# Altium schematic sheet TDS Sensor Unit.SchDoc
size A4; SheetNumber: 6; SheetTotal: 8
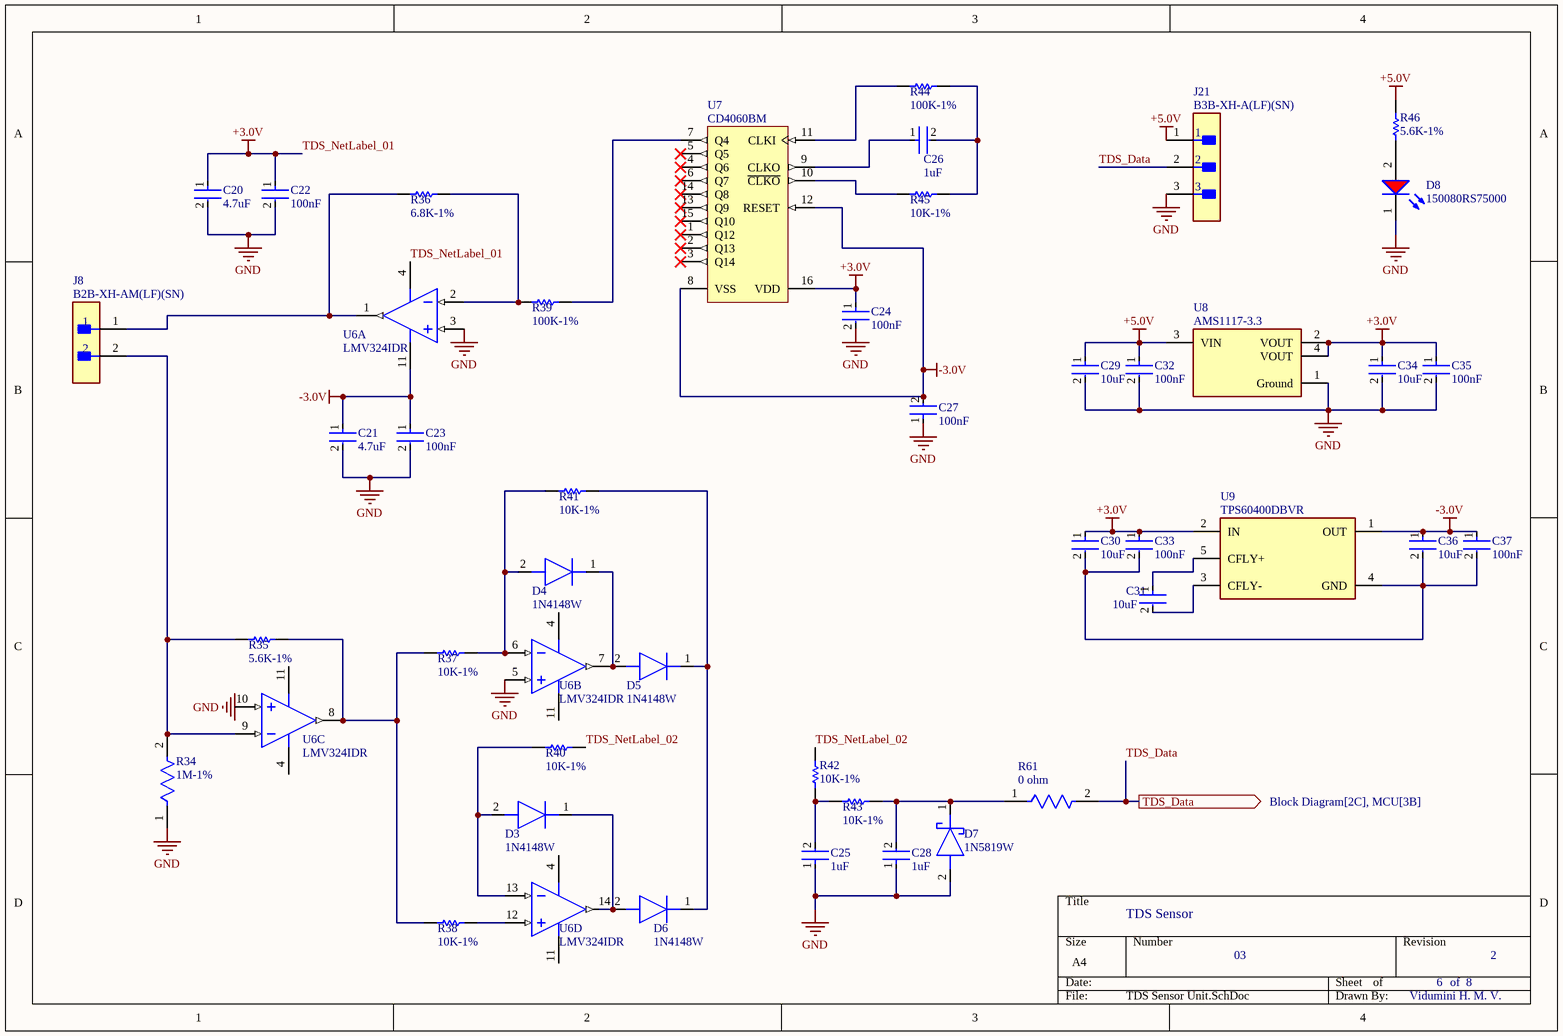
[diagram p0: TDS Sensor Unit.SchDoc]

## Parts
C20  4.7uF  [FP-1206-L_3_2_0_2-W_1_6_0-MFG]
C21  4.7uF  [FP-1206-L_3_2_0_2-W_1_6_0-MFG]
C22  100nF  [FP-1206-L_3_2_0_2-W_1_6_0-IPC_C]
C23  100nF  [FP-1206-L_3_2_0_2-W_1_6_0-IPC_C]
C24  100nF  [FP-1206-L_3_2_0_2-W_1_6_0-IPC_C]
C25  1uF  [FP-0805-L_2_01_0_2-W_1_25-MFG]
C26  1uF  [FP-0805-L_2_01_0_2-W_1_25-MFG]
C27  100nF  [FP-1206-L_3_2_0_2-W_1_6_0-IPC_C]
C28  1uF  [FP-0805-L_2_01_0_2-W_1_25-MFG]
C29  10uF  [FP-1206-L_3_2_0_2-W_1_6_0-IPC_B]
C30  10uF  [FP-1206-L_3_2_0_2-W_1_6_0-IPC_B]
C31  10uF  [FP-1206-L_3_2_0_2-W_1_6_0-IPC_B]
C32  100nF  [FP-1206-L_3_2_0_2-W_1_6_0-IPC_C]
C33  100nF  [FP-1206-L_3_2_0_2-W_1_6_0-IPC_C]
C34  10uF  [FP-1206-L_3_2_0_2-W_1_6_0-IPC_B]
C35  100nF  [FP-1206-L_3_2_0_2-W_1_6_0-IPC_C]
C36  10uF  [FP-1206-L_3_2_0_2-W_1_6_0-IPC_B]
C37  100nF  [FP-1206-L_3_2_0_2-W_1_6_0-IPC_C]
D3  1N4148W  [SOD3716X125N]
D4  1N4148W  [SOD3716X125N]
D5  1N4148W  [SOD3716X125N]
D6  1N4148W  [SOD3716X125N]
D7  1N5819W  [SODFL3618X110N]
D8  150080RS75000  [WL-SMCW_0805_150080xx75000]
J8  B2B-XH-AM(LF)(SN)  [FP-B2B-XH-AM_LF_SN-MFG]
J21  B3B-XH-A(LF)(SN)  [FP-B3B-XH-A_LF_SN-MFG]
R34  1M-1%  [FP-CRCW1206-e3-MFG]
R35  5.6K-1%  [RESC3116X65X40ML10T20]
R36  6.8K-1%  [RESC3116X65X40ML10T20]
R37  10K-1%  [RESC3116X65X40ML10T20]
R38  10K-1%  [RESC3116X65X40ML10T20]
R39  100K-1%  [RESC3116X65X40ML10T20]
R40  10K-1%  [RESC3116X65X40ML10T20]
R41  10K-1%  [RESC3116X65X40ML10T20]
R42  10K-1%  [RESC3116X65X40ML10T20]
R43  10K-1%  [RESC3116X65X40ML10T20]
R44  100K-1%  [RESC3116X65X40ML10T20]
R45  10K-1%  [RESC3116X65X40ML10T20]
R46  5.6K-1%  [RESC3116X65X40ML10T20]
R61  0 ohm  [FP-AF0603-IPC_B]
U6  LMV324IDR  [D0014A_V]  (parts A,B,C,D of 4)
U7  CD4060BM  [D0016A_M]
U8  AMS1117-3.3  [FP-AMS1117-IPC_C]
U9  TPS60400DBVR  [FP-DBV0005A-IPC_B]

## Ports
TDS_Data (out, see Block Diagram[2C], MCU[3B])

## Nets
+5.0V: C29.1 C32.1 J21.1 R46.2 U8.3(VIN)
-3.0V: C21.1 C23.1 C27.2 C36.1 C37.1 U6.11(GND) U7.8(VSS) U7.12(RESET) U9.1(OUT)
GND: C20.2 C21.2 C22.2 C23.2 C24.2 C25.1 C27.1 C28.1 C29.2 C32.2 C34.2 C35.2 D7.2(A) D8.1(K) J21.3 R34.1 U6.3(1IN+) U6.5(2IN+) U8.1(Ground)
TDS_NetLabel_01: C20.1 C22.1 C24.1 C30.1 C33.1 C34.1 C35.1 U6.4(VCC+) U7.16(VDD) U8.2(VOUT) U8.4(VOUT) U9.2(IN)  [also labelled +3.0V]
TDS_Data: J21.2 R61.2 ; port TDS_Data
TDS_NetLabel_02: R40.2 R42.1
NetC25_2: C25.2 R42.2 R43.1
NetC26_1: C26.1 U7.9(CLKO)
NetC26_2: C26.2 R44.2 R45.2
NetC28_2: C28.2 D7.1(K) R43.2 R61.1
NetC30_2: C30.2 C33.2 C36.2 C37.2 U9.4(GND)
NetC31_1: C31.1 U9.5(CFLY+)
NetC31_2: C31.2 U9.3(CFLY-)
NetD3_1: D3.1(K) D6.2(A) U6.14(4OUT)
NetD3_2: D3.2(A) R40.1 U6.13(4IN-)
NetD4_1: D4.1(K) D5.2(A) U6.7(2OUT)
NetD4_2: D4.2(A) R37.2 R41.1 U6.6(2IN-)
NetD5_1: D5.1(K) D6.1(K) R41.2
NetD8_2: D8.2(A) R46.1
NetJ8_1: J8.1 R36.1 U6.1(1OUT)
NetJ8_2: J8.2 R34.2 R35.1 U6.9(3IN-)
NetR35_2: R35.2 R37.1 R38.1 U6.8(3OUT)
NetR36_2: R36.2 R39.1 U6.2(1IN-)
NetR38_2: R38.2 U6.12(4IN+)
NetR39_2: R39.2 U7.7(Q4)
NetR44_1: R44.1 U7.11(CLKI)
NetR45_1: R45.1 U7.10(~{CLKO})

Not connected (* = marked no-connect by the designer): U6 10(3IN+); U7 1(Q12)* 2(Q13)* 3(Q14)* 4(Q6)* 5(Q5)* 6(Q7)* 13(Q9)* 14(Q8)* 15(Q10)*

## Notes on the sheet
- TDS Sensor
- 03
- 6
- of  8
- 2
- Vidumini H. M. V.
- Labels drawn without touching a wire or pin: GND

## Library data of the parts
C20 C21 = CMP-2000-05864-2: General Purpose Ceramic Capacitor, 1206, 4.7uF, 10%, X5R, 15%, 25V; Dissipation Factor: 3%; Depth: 1.6mm; Packaging: Tape and Reel; Termination: SMD/SMT; Series: -; RoHS Compliant: Yes; Voltage Rating (DC): 25V; Case Code (Metric): 3216; Min Operating Temperature: -55°C; Height: 0.07mm; Length: 3.2mm; Package Quantity: 1; Radiation Hardening: No; Dielectric: X5R; Mount: Surface Mount; REACH SVHC: No SVHC; Voltage: 25V; Thickness: 0.07inch; Width: 0.063inch; Lead Free: Lead Free; Max Operating Temperature: 85°C; Case/Package: 1206; Construction: Flat; Capacitance: 4.7uF; Voltage Rating: 25V; Number of Pins: 2; Contact Plating: Tin; Case Code (Imperial): 1206; Tolerance: 10%
C22-C24 C27 C32 C33 C35 C37 = CMP-04427-013576-1: General Purpose Ceramic Capacitor, 1206, 100nF, 5%, X7R, 15%, 100V; Max Operating Temperature: 125°C; Depth: 1.6mm; Package Quantity: 1; Thickness: 0.05inch; Number of Pins: 2; Height: 1.27mm; Voltage Rating (DC): 100V; Radiation Hardening: No; Termination: SMD/SMT; Construction: Flat; REACH SVHC: No SVHC; Case/Package: 1206; Case Code (Imperial): 1206; Tolerance: 5%; Width: 0.063inch; Voltage: 100V; Packaging: Tape and Reel; Voltage Rating: 100V; Case Code (Metric): 3216; Capacitance: 100nF; Min Operating Temperature: -55°C; Length: 3.2mm; Dielectric: X7R; Mount: Surface Mount; Dielectric Material: Ceramic; Contact Plating: Tin; RoHS Compliant: Yes; Lead Free: Lead Free; Series: -
C25 C26 C28 = CMP-2007-04692-2: General Purpose Ceramic Capacitor, 0805, 1uF, 10%, X7R, 15%, 25V; Max Operating Temperature: 125°C; Contact Plating: Tin; Tolerance: 10%; Dielectric: X7R; Case/Package: 0805; Package Quantity: 3000; Width: 0.049inch; Voltage Rating: 25V; Capacitance: 1uF; Lead Free: Lead Free; REACH SVHC: No SVHC; RoHS Compliant: Yes; Case Code (Imperial): 0805; Packaging: Tape and Reel; Dielectric Material: Ceramic; Series: -; Construction: Flat; Termination: SMD/SMT; Radiation Hardening: No; Voltage: 25V; Height: 1.4mm; Number of Pins: 2; Mount: Surface Mount; Length: 2.01mm; Depth: 1.25mm; Voltage Rating (DC): 25V; Min Operating Temperature: -55°C; Thickness: 0.037inch; Case Code (Metric): 2012
C29-C31 C34 C36 = CMP-2000-05863-2: General Purpose Ceramic Capacitor, 1206, 10uF, 10%, X5R, 15%, 25V; Height: 0.07mm; Packaging: Tape and Reel; Depth: 1.6mm; Voltage Rating (DC): 25V; Dielectric Material: Ceramic; Contact Plating: Tin; Width: 0.063inch; Capacitance: 10uF; Length: 3.2mm; Thickness: 0.07inch; Voltage Rating: 25V; RoHS Compliant: Yes; Min Operating Temperature: -55°C; Construction: Flat; Case Code (Imperial): 1206; Case Code (Metric): 3216; Mount: Surface Mount; Radiation Hardening: No; Termination: SMD/SMT; Package Quantity: 1; REACH SVHC: No SVHC; Number of Pins: 2; Tolerance: 10%; Series: -; Case/Package: 1206; Voltage: 25V; Dielectric: X5R; Max Operating Temperature: 85°C; Lead Free: Lead Free
D3-D6 = 1N4148W: Diode; Manufacturer_Name: Rectron; Datasheet Link: https://www.rectron.com/public/product_datasheets/1n4148w.pdf; Height: 1.25mm; Manufacturer_Part_Number: 1N4148W; Mouser Part Number: 583-1N4148W; Mouser Price/Stock: https://www.mouser.co.uk/ProductDetail/Rectron/1N4148W?qs=rrS6PyfT74dlwuw0ST2zKA%3D%3D; Arrow Part Number: 1N4148W; Arrow Price/Stock: https://www.arrow.com/en/products/1n4148w/rectron?region=nac
D7 = 1N5819W: Schottky Diode; Manufacturer_Name: Shandong Jingdao Microelectronics; Datasheet Link: https://datasheet.lcsc.com/szlcsc/Shandong-Jingdao-Microelectronics-1N5819W_C169540.pdf; Height: 1.1mm; Manufacturer_Part_Number: 1N5819W
D8 = CMP-1426-00011-2: NexarPartId: 29717781; Peak Wavelength: 630nm; Wavelength: 625nm; Viewing Angle: 140°; Test Current: 20mA; Forward Voltage: 2V; Forward Current: 100mA; Lens Style: Clear, Rectangular; Color: Red; Luminous Intensity: 150mcd; Max Reverse Voltage (DC): 5V; Length: 2mm; Case Code (Imperial): 0805; RoHS: Compliant; Max Operating Temperature: 85°C; Height: 700µm; Packaging: Tape and Reel; Case/Package: 0805; REACH SVHC: Unknown; Dominant Wavelength: 625nm; Min Operating Temperature: -40°C; Case Code (Metric): 2012; Mount: Surface Mount; Width: 1.25mm
J8 = CMP-17439-000037-1: CONN HEADER VERT 2POS 2.5MM; Max Voltage Rating (AC): 250V; Connector Type: Male Pin; Contact Resistance: 20mR; Max Current Rating: 3A; Number of Positions: 2; Series: XH; Contact Material: Brass; Mount: Through Hole; Housing Material: Polyamide; Contact Plating: Tin; Termination: Solder; Max Operating Temperature: 85°C; Depth: 5.75mm; Packaging: Bulk; Min Operating Temperature: -25°C; Contact Type: Male Pin; Color: Green; Pitch: 2.5mm; Length: 7.4mm; Lead Free: Lead Free; Number of Rows: 1; Fastening Type: Detent; Housing Color: White; Orientation: Straight
J21 = CMP-17439-000014-3: CONN HEADER VERT 3POS 2.5MM; Max Voltage Rating (DC): 250V; Number of Positions: 3; Current Rating: 3A; Gender: Male; Wire/Cable Gauge: 22AWG; Contact Resistance: 20mR; Insulation Resistance: 1GR; Insulation Material: Nylon; Contact Plating: Tin; Depth: 5.75mm; Contact Type: Male Pin; Max Operating Temperature: 85°C; Insulation Color: Natural; Voltage Rating (AC): 250V; Color: Natural; Connector Type: Header; Orientation: Straight; Fastening Type: Detent; Housing Color: White; Min Operating Temperature: -25°C; Termination: Solder; Voltage Rating: 250V; Series: XH; Pitch: 2.5mm; Contact Shape: Square; Number of Rows: 1; Lead Free: Lead Free; Packaging: Bulk; Mount: Through Hole; Flammability Rating: UL94 V-0; Max Voltage Rating (AC): 250V; REACH SVHC: No SVHC; Housing Material: Polyamide; Contact Material: Brass; Lead Pitch: 2.5mm; Contact Finish - Mating: TIN; Length: 9.9mm; Max Current Rating: 3A; Number of Contacts: 3
R34 = CMP-2003-01906-2: RES Thick Film, 1MΩ, 1%, 0.25W, 100ppm/°C, 1206; Voltage Rating (DC): 200V; Max Power Dissipation: 250mW; Resistance: 1MR; Package Quantity: 10; Case Code (Imperial): 1206; Weight: 0.000353oz; Height: 0.024inch; Number of Terminations: 2; Case/Package: 1206; Length: 3.2mm; Military Standard: Not; Features: Automotive AEC-Q200; Voltage Rating: 200V; Termination: SMD/SMT; Tolerance: 1%; Lead Free: Lead Free; Number of Pins: 2; Composition: Thick Film; Width: 0.063inch; Temperature Coefficient: 100ppm/°C; Packaging: Tape and Reel; Min Operating Temperature: -55°C; Max Operating Temperature: 155°C; Case Code (Metric): 3216; Contact Plating: Tin; Depth: 1.6mm; Radiation Hardening: No; Power Rating: 250mW; Working Voltage: 200V
R35-R38 R40-R43 R45 R46 = CMP-1014-00623-2: Chip Resistor, 10 KOhm, +/- 1%, 0.25 W, -55 to 155 degC, 1206 (3216 Metric), RoHS, Tape and Reel; Manufacturer: Yageo; Voltage Rating: 200V; Resistance: 10KOhm; Temperature Coefficient: 100ppm/degreesC; Power Rating: 250mW; Packaging: TapeandReel; Termination: SMD/SMT; REACH SVHC: Unknown; Tolerance: 1%; Height: 0.55mm; Composition: ThickFilm; Max Operating Temperature: 155degC; Datasheet Version: Rev. 5, 10/2016; Lead Free: LeadFree; Case Code (Metric): 3216; Depth: 1.6mm; Package Quantity: 5000; RoHSCompliant: true; Military Standard: Not; Case/Package: 1206; Case Code (Imperial): 1206; Min Operating Temperature: -55degC; Datasheet URL: http://www.yageo.com/NewPortal/yageodocoutput?fileName=/pdf/R-Chip/PYu-RC_Group_51_RoHS_L_5.pdf; Length: 3.1mm; Manufacturer URL: http://www.yageo.com/; Package Reference: 1206.0; Width: 1.6mm; Package Description: 2-Pin Surface Mount Device, Body 3.1 x 1.6 mm
R39 R44 = CMP-2100-03674-1: Chip Resistor, 100 KOhm, +/- 1%, 0.25 W, -55 to 155 degC, 1206 (3216 Metric), RoHS, Tape and Reel; Manufacturer: Yageo; Voltage Rating: 200V; Temperature Coefficient: 100ppm/degreesC; Power Rating: 250mW; Case Code (Metric): 3216; Composition: ThickFilm; Lead Free: LeadFree; Max Operating Temperature: 155degC; Case/Package: 1206; Min Operating Temperature: -55degC; Depth: 1.6mm; RoHSCompliant: true; Datasheet URL: http://www.yageo.com/NewPortal/yageodocoutput?fileName=/pdf/R-Chip/PYu-RC_Group_51_RoHS_L_5.pdf; Datasheet Version: Rev. 5, 10/2016; Package Reference: 1206.0; Packaging: TapeandReel; Resistance: 100KOhm; Manufacturer URL: http://www.yageo.com/; Tolerance: 1%; Height: 0.55mm; REACH SVHC: NoSVHC; Case Code (Imperial): 1206; Length: 3.1mm; Package Description: 2-Pin Surface Mount Device, Body 3.1 x 1.6 mm; Termination: SMD/SMT
R61 = CMP-03412-043191-1: Anti-Sulfurated Chip Resistors Automotive Grade 1.5kΩ 1% 100ppm/°C 0603; Resistance: 1.5kR; Max Power Dissipation: 100mW; Length: 0.063inch; Packaging: Tape and Reel; Tolerance: 1%; RoHS Compliant: Yes; Series: AF; Temperature Coefficient: 100ppm/°C; Case/Package: 0603; Height: 0.022inch; Min Operating Temperature: -55°C; Resistor Type: Thick Film; Features: Moisture Resistant; Width: 0.031inch; Number of Terminations: 2; Max Operating Temperature: 155°C
U6 = CMP-1685-00010-1: Quad Low-Voltage Rail-to-Rail Output Operational Amplifier, 2.7 to 5.5 V, -40 to 125 degC, 14-Pin SOIC (D), Green (RoHS & no Sb/Br), Tape and Reel; ComponentLink3Description: Package Specification; ComponentLink2URL: http://www.ti.com/lit/ds/symlink/lmv324.pdf; ComponentLink3URL: http://www.ti.com/lit/ml/mpds177g/mpds177g.pdf; DatasheetVersion: SLOS263W, 10/2014; ComponentLink1URL: http://www.ti.com/; Code_JEDEC: MS-012; ComponentLink1Description: Manufacturer URL; PackageDescription: 14-Pin Small Outline Integrated Circuit, Body 8.65 x 3.9 mm, Pitch 1.27 mm; PackageReference: D0014A; ComponentLink2Description: Datasheet
U7 = CMP-1086-00003-4: CMOS 14-Stage Ripple Carry Binary Counter / Divider and Oscillator, 3 to 18 V, -55 to 125 degC, 16-Pin SOIC (D), Green (RoHS & no Sb/Br), Tube; Manufacturer: Texas Instruments; VDD: 3 to 18 V; tPHL, tPLH (typ) @ 5 V: 370 ns; PartNumber: CD4060BM; ComponentLink3Description: Package Specification; ComponentLink1Description: Manufacturer URL; ComponentLink2URL: http://www.ti.com/lit/ds/symlink/cd4060b.pdf; Mounting Technology: Surface Mount; PackageDescription: 16-Pin Plastic Small-Outline Package, Body 9.9 x 3.9 mm, Pitch 1.27 mm; ComponentLink2Description: Datasheet; ComponentLink1URL: http://www.ti.com; PackageReference: D0016A; Temperature Range: -55 to 125 degC; ComponentLink3URL: http://www.ti.com/lit/ml/mpds178g/mpds178g.pdf; PackageVersion: 4040047-6/M; Note1: Green (RoHS & no Sb/Br); Packing: Tube; DatasheetVersion: SCHS049C
U8 = CMP-209535-000001-1: LDO Voltage Regulators 1A, 3.3V; Manufacturer: Advanced Monolithic Systems; Dropout Voltage: 1.1V; Output Type: Fixed; Nominal Supply Current: 5mA; Max Power Dissipation: 1.2W; Max Supply Voltage: 15V; Number Of Outputs: 1; Standoff Height: 0.64mm; Max Junction Temp: +125°C; Height: 1.8mm; Package: AMS1117; Device Class L2: Power Management ICs; ComponentLink2Description: Datasheet; ComponentLink2URL: http://www.advanced-monolithic.com/pdf/ds1117.pdf; Category: IC; RoHS: TRUE; Automotive: No; Device Class L1: Integrated Circuits (ICs); Output Current: 1A; Device Class L3: Voltage Regulators - Linear; Temperature: -40°C to +125°C; Output Voltage: 3.3V; Manufacturer Part Number: AMS1117-3.3; Temperature Range Low: -40°C; Octopart: https://octopart.com/ams1117-3.3-advanced+monolithic+systems-25899300; Lead Free: Yes; Ipc Land Pattern Name: SOT229P700X180-4; Temperature Range High: +125°C
U9 = CMP-0391-00019-3: IC REG CHARG PUMP INV 60MA SOT23; Number of Outputs: 1; Min Supply Voltage: 1.8V; Max Supply Voltage: 5.25V; Max Output Voltage: -5.25V; Operating Supply Current: 125uA; Logic Function: Inverting; Min Output Voltage: -1.6V; Output Type: Adjustable; Switching Frequency: 250kHz; Synchronous Rectifier: No; Min Operating Temperature: -40°C; Number of Pins: 5; Package Quantity: 3000; Min Input Voltage: 1.8V; Max Operating Temperature: 85°C; Packaging: Tape and Reel; Output Current: 60mA; Max Input Voltage: 5.25V; Weight: 0.000459oz; Lead Free: Lead Free; Output Voltage: -5.25V; Contact Plating: Gold; Radiation Hardening: No; Quiescent Current: 125uA; Max Output Current: 60mA; REACH SVHC: No SVHC; Case/Package: SOT-23-5